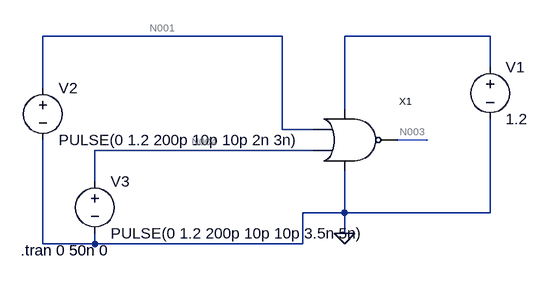
[diagram p0: schematic test_NOR.asc]
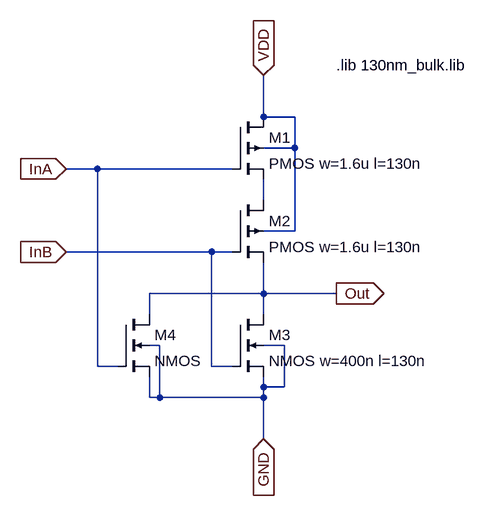
[diagram p1: sub-circuit nor.asc]
test_NOR.asc, the LTspice schematic file:
Version 4
SHEET 1 880 680
WIRE 112 0 -256 0
WIRE 432 0 208 0
WIRE 432 48 432 0
WIRE -256 80 -256 0
WIRE 208 112 208 0
WIRE 112 144 112 0
WIRE 160 144 112 144
WIRE 336 160 288 160
WIRE 160 176 -176 176
WIRE -176 224 -176 176
WIRE 208 272 208 208
WIRE 208 272 144 272
WIRE 432 272 432 128
WIRE 432 272 208 272
WIRE 208 304 208 272
WIRE -256 320 -256 160
WIRE -176 320 -176 304
WIRE -176 320 -256 320
WIRE 144 320 144 272
WIRE 144 320 -176 320
FLAG 208 304 0
SYMBOL NOR 192 160 R0
SYMATTR InstName X1
SYMBOL voltage 432 32 R0
WINDOW 123 0 0 Left 0
WINDOW 39 0 0 Left 0
SYMATTR InstName V1
SYMATTR Value 1.2
SYMBOL voltage -256 64 R0
WINDOW 123 0 0 Left 0
WINDOW 39 0 0 Left 0
SYMATTR InstName V2
SYMATTR Value PULSE(0 1.2 200p 10p 10p 2n 3n)
SYMBOL voltage -176 208 R0
WINDOW 123 0 0 Left 0
WINDOW 39 0 0 Left 0
SYMATTR InstName V3
SYMATTR Value PULSE(0 1.2 200p 10p 10p 3.5n 5n)
TEXT -290 330 Left 2 !.tran 0 50n 0

nor.asc, the sub-circuit schematic file:
Version 4
SHEET 1 880 680
WIRE 240 16 240 -48
WIRE 288 16 240 16
WIRE 288 64 288 16
WIRE 288 64 240 64
WIRE -16 96 -64 96
WIRE 192 96 -16 96
WIRE 240 144 240 112
WIRE 288 192 288 64
WIRE 288 192 240 192
WIRE 160 224 -64 224
WIRE 192 224 160 224
WIRE 240 288 240 240
WIRE 240 288 64 288
WIRE 352 288 240 288
WIRE 64 320 64 288
WIRE 240 320 240 288
WIRE 80 368 64 368
WIRE 272 368 240 368
WIRE -16 400 -16 96
WIRE 16 400 -16 400
WIRE 160 400 160 224
WIRE 192 400 160 400
WIRE 240 432 240 416
WIRE 272 432 272 368
WIRE 272 432 240 432
WIRE 64 448 64 416
WIRE 80 448 80 368
WIRE 80 448 64 448
WIRE 240 448 240 432
WIRE 240 448 80 448
WIRE 240 512 240 448
FLAG -64 96 InA
IOPIN -64 96 In
FLAG -64 224 InB
IOPIN -64 224 In
FLAG 240 -48 VDD
IOPIN 240 -48 In
FLAG 240 512 GND
IOPIN 240 512 In
FLAG 352 288 Out
IOPIN 352 288 Out
SYMBOL pmos4 192 16 R0
SYMATTR InstName M1
SYMATTR Value2 l=130n w=1.6u
SYMATTR Value PMOS w=1.6u l=130n
SYMBOL pmos4 192 144 R0
SYMATTR InstName M2
SYMATTR Value2 l=130n w=1.6u
SYMATTR Value PMOS w=1.6u l=130n
SYMBOL nmos4 192 320 R0
SYMATTR InstName M3
SYMATTR Value2 l=130n w=400n
SYMATTR Value NMOS w=400n l=130n
SYMBOL nmos4 16 320 R0
SYMATTR InstName M4
SYMATTR Value2 l=130n w=400n
TEXT 352 -64 Left 2 !.lib 130nm_bulk.lib

The netlist it stands for:
* test_NOR.asc
XX1 N001 N004 N002 0 N003 nor
V1 N002 0 1.2
V2 N001 0 PULSE(0 1.2 200p 10p 10p 2n 3n)
V3 N004 0 PULSE(0 1.2 200p 10p 10p 3.5n 5n)

* block symbol definitions
.subckt nor InA InB VDD GND Out
M1 VDD InA N001 VDD PMOS w=1.6u l=130n l=130n w=1.6u
M2 N001 InB Out VDD PMOS w=1.6u l=130n l=130n w=1.6u
M3 Out InB GND GND NMOS w=400n l=130n l=130n w=400n
M4 Out InA GND GND NMOS l=130n w=400n
.lib 130nm_bulk.lib
.ends nor

.model NMOS NMOS
.model PMOS PMOS
.lib standard.mos
.tran 0 50n 0
.backanno
.end

* Results of the author's LTspice run, read from the files saved beside the schematic
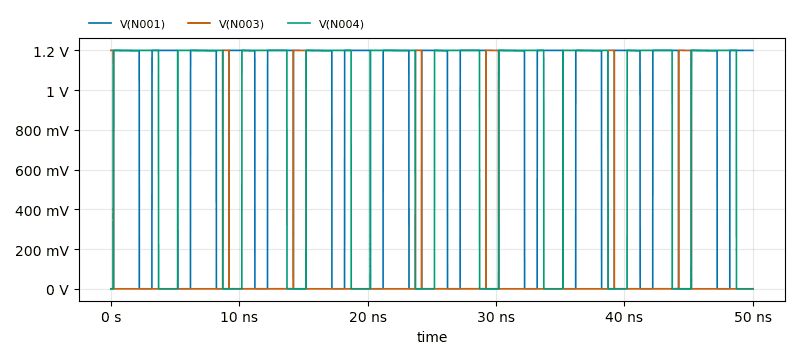
[diagram p2: Transient Analysis of test_NOR.asc, plotted from the saved traces]
* Transient Analysis, 1 run:
*   V(N001): min 0 V, max 1.2 V, average 814.6 mV, rms 988.3 mV, last 1.2 V
*   V(N003): min 0 V, max 1.2 V, average 111.8 mV, rms 365.7 mV, last 0 V
*   V(N004): min 0 V, max 1.2 V, average 842.4 mV, rms 1.005 V, last 0 V